# Altium schematic sheet Sheet1.SchDoc
size A; SheetNumber: 1; SheetTotal: 1
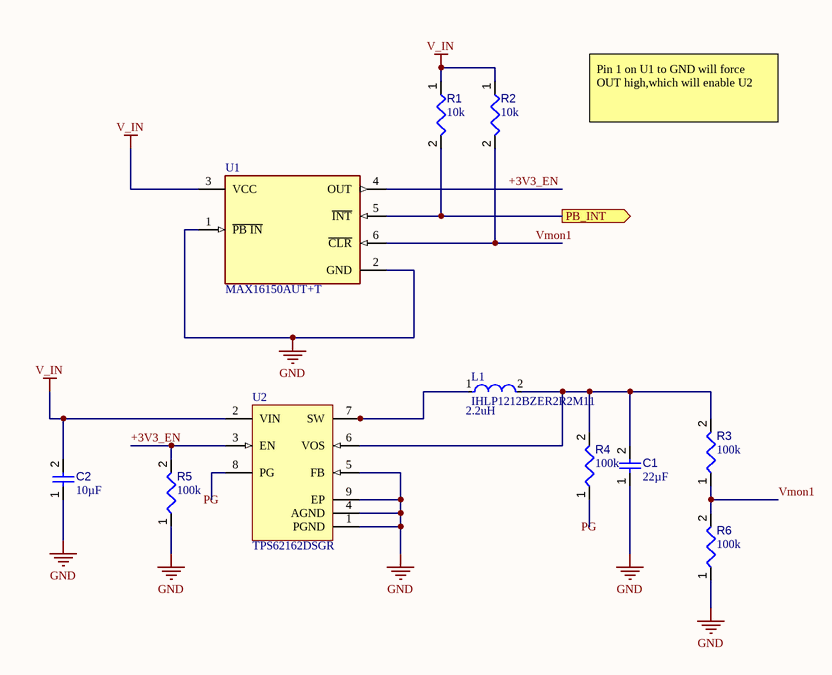
[diagram p0: Sheet1.SchDoc]

## Parts
C1  value 22µF  [CAPC0805(2012)145_L]  (hidden comment: Capacitor 22µF +/-40% 16V 0805)
C2  value 10µF  [CAPC0603(1608)100_L]  (hidden comment: Capacitor 10µF +/-20% 10V 0603)
L1  IHLP1212BZER2R2M11  Inductance: 2.2uH  [FP-IHLP-1212BZ-11-MFG]
R1  value 10k  [RESC0402(1005)_L]  (hidden comment: Resistor 10K  +/-1 % 0402 63 mW)
R2  value 10k  [RESC0402(1005)_L]  (hidden comment: Resistor 10K  +/-1 % 0402 63 mW)
R3  value 100k  [RESC0402(1005)_L]  (hidden comment: Resistor 100K +/-1 % 0402 63 mW)
R4  value 100k  [RESC0402(1005)_L]  (hidden comment: Resistor 100K +/-1 % 0402 63 mW)
R5  value 100k  [RESC0402(1005)_L]  (hidden comment: Resistor 100K +/-1 % 0402 63 mW)
R6  value 100k  [RESC0402(1005)_L]  (hidden comment: Resistor 100K +/-1 % 0402 63 mW)
U1  MAX16150AUT+T  [FP-U6-1-MFG]
U2  TPS62162DSGR  [DSG0008A_V]

## Ports
PB_INT (out)

## Nets
GND: C1.1 C2.1 R5.1 R6.1 U1.1(~{PB_IN}) U1.2(GND) U2.1(PGND) U2.4(AGND) U2.5(FB) U2.9(EP)
V_IN: C2.2 R1.1 R2.1 U1.3(VCC) U2.2(VIN)
+3V3_EN: R5.2 U1.4(OUT) U2.3(EN)
PB_INT: R1.2 U1.5(~{INT}) ; port PB_INT
PG: R4.1 U2.8(PG)
Vmon1: R2.2 R3.1 R6.2 U1.6(~{CLR})
NetC1_2: C1.2 L1.2 R3.2 R4.2 U2.6(VOS)
NetL1_1: L1.1 U2.7(SW)

## Notes on the sheet
- Pin 1 on U1 to GND will force OUT high,which will enable U2

## Library data of the parts
C1 = CMP-001-00081-4: Chip Capacitor, 22µF +/-40%, 16V, 0805, Thickness 1.45 mm; Tolerance: 5%; Voltage Rating: 16V; Mounting Technology: SMT; Pins: 2; Max Operating Temperature: 85°C; Case/Package: 0805; Min Operating Temperature: -55°C
C2 = CMP-001-00075-4: Chip Capacitor, 10µF +/-20%, 10V, 0603, Thickness 1 mm; Tolerance: 10%; Voltage Rating: 10V; Max Operating Temperature: 85°C; Pins: 2; Case/Package: 0603; Mounting Technology: SMT; Min Operating Temperature: -55°C
L1 = CMP-02424-000689-1: FIXED IND 2.2UH 3A 46 MOHM SMD; DC Resistance (DCR): 46mR; Inductance Tolerance: 20%; Saturation Current: 3.3A; Self Resonant Frequency: 55MHz; Core Material: Metal; Shielding: Shielded; Test Frequency: 100kHz; RMS Current (Irms): 3A; Max DC Current: 3A; Contact Plating: Tin; Mount: Surface Mount; Series: IHLP-1212BZ-11; Current Rating: 3A; Height - Seated (Max): 0.079inch; Radiation Hardening: No; Package Quantity: 3000; Max Operating Temperature: 125°C; Military Standard: Not; Depth: 3.2mm; Rated Current-Max: 3A; Height: 2mm; Lead Free: Lead Free; Termination: SMD/SMT; RoHS Compliant: Yes; Tolerance: 20%; Packaging: Tape and Reel; Case/Package: 1212; Number of Pins: 2; Min Operating Temperature: -55°C; Width: 3mm; Length: 3.6mm
R1 R2 = CMP-009-00149-3: Chip Resistor, 10 kOhms, +/-1 %, 63 mW, -55 to 125 degC, 0402; Power: 63mW; Tolerance: 1%; Min Operating Temperature: -55°C; Case/Package: 0402; Max Operating Temperature: 155°C; Pins: 2
R3-R6 = CMP-009-00168-3: Chip Resistor, 100 kOhms, +/-1 %, 63 mW, -55 to 155 degC, 0402; Tolerance: 1%; Power: 63mW; Max Operating Temperature: 155°C; Min Operating Temperature: -55°C; Pins: 2; Case/Package: 0402
U1 = CMP-05723-001129-1: IC SUPERVISOR 1 CHANNEL SOT23-6
U2 = CMP-0323-00316-3: Buck Step Down Regulator with 3 to 17 V Input and 3.3 V Output, -40 to 85 degC, 8-Pin WSON (DSG), Green (RoHS & no Sb/Br); Manufacturer: Texas Instruments; SubFamily: Step-Down Regulator; Synchronous Rectification: TRUE; Vout(Max)(V): 3.3; Regulated Outputs(#): 1; Switch Current Limit(Typ)(A): 1.8; Duty Cycle(Max)(%): 100; Iq(Typ)(mA): 0.017; Rating: Catalog; Vin(Min)(V): 3; Vin(Max)(V): 17; ComponentLink2URL: http://www.ti.com/litv/pdf/mpds308a; ComponentLink3URL: Samples URL:http://www.ti.com/product/tps62162#samples; Eco-Plan: Green (RoHS & no Sb/Br); PackageDescription: 8-Pin Plastic Small Outline No-Lead, 2 x 2 x 0.8 mm Body, 0.5 mm Pitch, Exposed Pad; DatasheetVersion: SLVSAM2A; Topology: Buck; PartNumber: TPS62162DSGR; PackageReference: DSG0008A; ComponentLink1URL: http://www.ti.com/general/docs/lit/getliterature.tsp?genericPartNumber=TPS62162&fileType=pdf; PackageVersion: revB, Oct-2010; Mounting Technology: Surface Mount; Code_JEDEC: MO-229; Iout(Max)(A): 1; ComponentLink1Description: Datasheet; ComponentLink2Description: Package Specification; Vout(Min)(V): 3.3; ComponentLink3Description: URL Link1; Preset Vout(V): 3.3